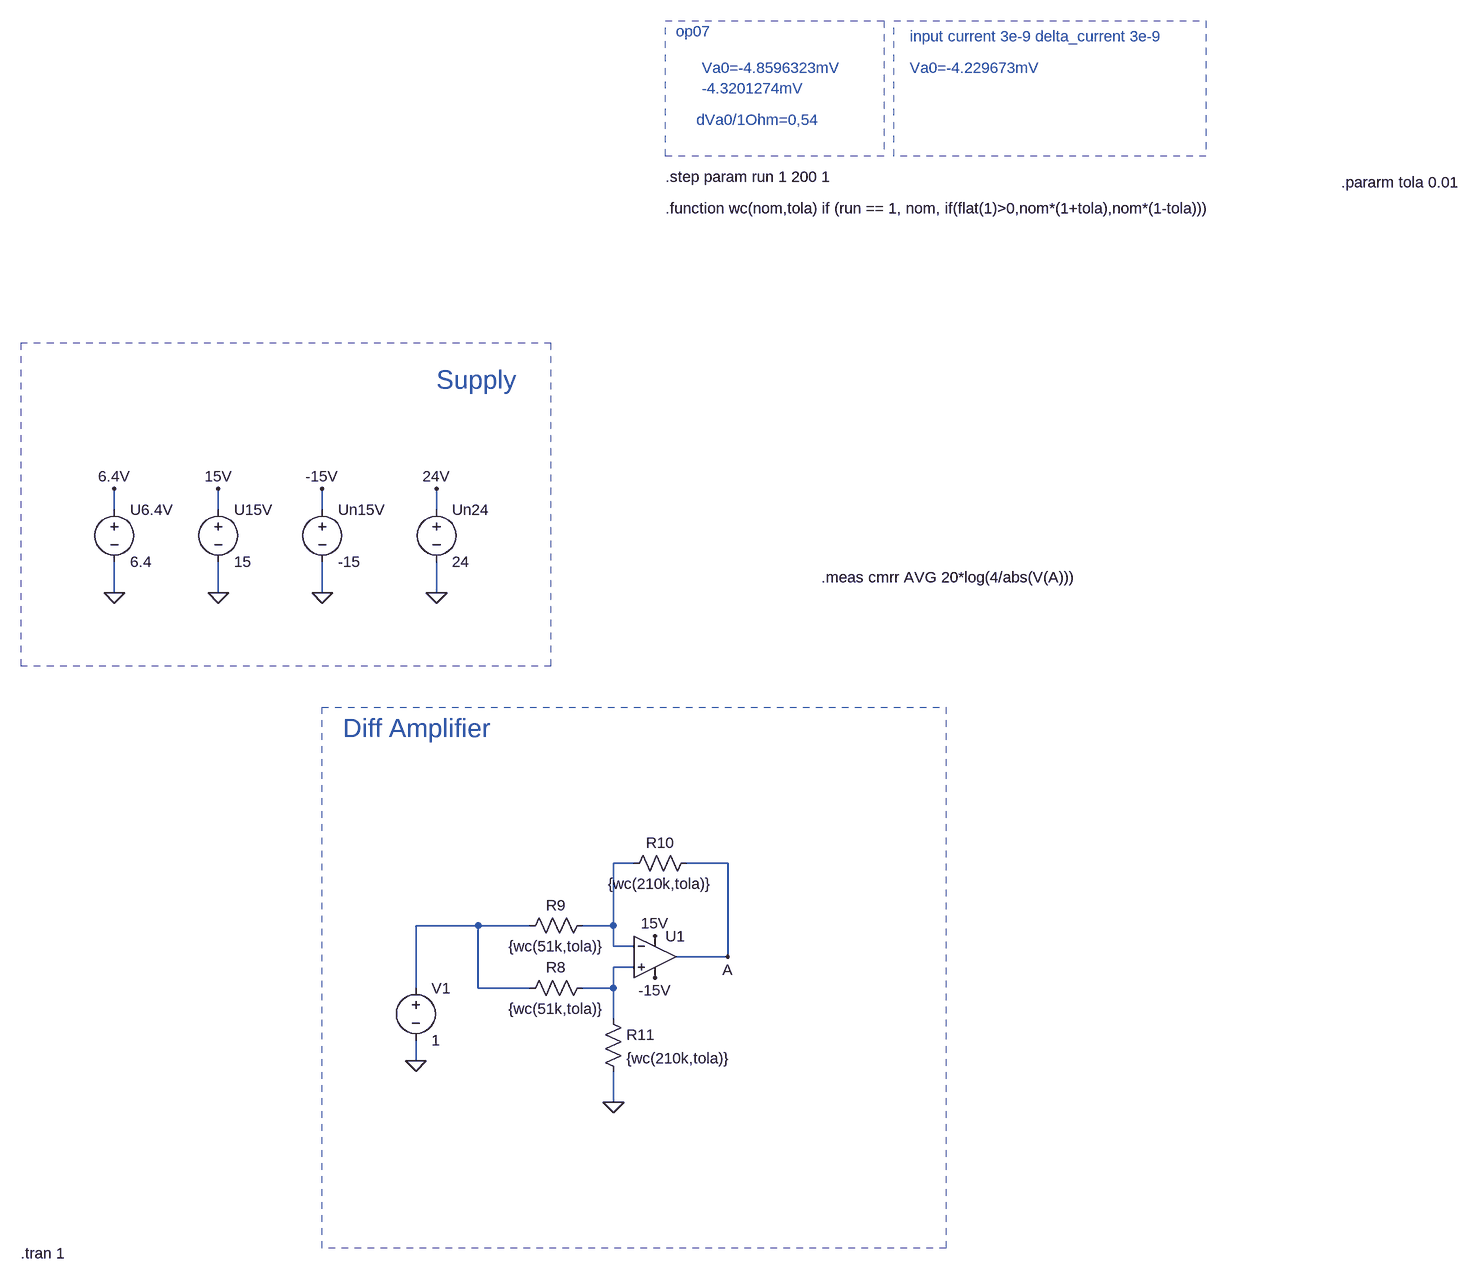
[diagram p0: schematic diff_amp_monte_carlo.asc]
diff_amp_monte_carlo.asc, the LTspice schematic file:
Version 4
SHEET 1 1512 1172
WIRE -1760 -544 -1760 -576
WIRE -1600 -544 -1600 -576
WIRE -1440 -544 -1440 -576
WIRE -1264 -544 -1264 -576
WIRE -1760 -416 -1760 -464
WIRE -1600 -416 -1600 -464
WIRE -1440 -416 -1440 -464
WIRE -1264 -416 -1264 -464
WIRE -960 0 -992 0
WIRE -816 0 -880 0
WIRE -1200 96 -1296 96
WIRE -1120 96 -1200 96
WIRE -992 96 -992 0
WIRE -992 96 -1040 96
WIRE -992 128 -992 96
WIRE -960 128 -992 128
WIRE -816 144 -816 0
WIRE -816 144 -896 144
WIRE -960 160 -992 160
WIRE -1296 192 -1296 96
WIRE -1200 192 -1200 96
WIRE -1120 192 -1200 192
WIRE -992 192 -992 160
WIRE -992 192 -1040 192
WIRE -992 240 -992 192
WIRE -1296 304 -1296 272
WIRE -992 368 -992 320
FLAG -1760 -416 0
FLAG -1760 -576 6.4V
FLAG -1600 -416 0
FLAG -1600 -576 15V
FLAG -1440 -416 0
FLAG -1440 -576 -15V
FLAG -992 368 0
FLAG -1264 -416 0
FLAG -1264 -576 24V
FLAG -816 144 A
FLAG -928 112 15V
FLAG -928 176 -15V
FLAG -1296 304 0
SYMBOL voltage -1760 -560 R0
WINDOW 123 0 0 Left 0
WINDOW 39 0 0 Left 0
SYMATTR InstName U6.4V
SYMATTR Value 6.4
SYMBOL voltage -1600 -560 R0
WINDOW 123 0 0 Left 0
WINDOW 39 0 0 Left 0
SYMATTR InstName U15V
SYMATTR Value 15
SYMBOL voltage -1440 -560 R0
WINDOW 123 0 0 Left 0
WINDOW 39 0 0 Left 0
SYMATTR InstName Un15V
SYMATTR Value -15
SYMBOL res -1024 80 R90
WINDOW 0 0 56 VBottom 2
WINDOW 3 32 56 VTop 2
SYMATTR InstName R9
SYMATTR Value {wc(51k,tola)}
SYMBOL res -1024 176 R90
WINDOW 0 0 56 VBottom 2
WINDOW 3 32 56 VTop 2
SYMATTR InstName R8
SYMATTR Value {wc(51k,tola)}
SYMBOL res -1008 224 R0
SYMATTR InstName R11
SYMATTR Value {wc(210k,tola)}
SYMBOL res -864 -16 R90
WINDOW 0 0 56 VBottom 2
WINDOW 3 32 56 VTop 2
SYMATTR InstName R10
SYMATTR Value {wc(210k,tola)}
SYMBOL voltage -1264 -560 R0
WINDOW 123 0 0 Left 0
WINDOW 39 0 0 Left 0
SYMATTR InstName Un24
SYMATTR Value 24
SYMBOL Opamps\\UniversalOpamp2 -928 144 R0
SYMATTR InstName U1
SYMATTR Value2 Avol=300k GBW=10Meg Slew=10Meg
SYMBOL voltage -1296 176 R0
WINDOW 123 0 0 Left 0
WINDOW 39 0 0 Left 0
SYMATTR InstName V1
SYMATTR Value 1
TEXT -1264 -744 Left 4 ;Supply
TEXT -1408 -208 Left 4 ;Diff Amplifier
TEXT -856 -1224 Left 2 ;Va0=-4.8596323mV
TEXT -864 -1144 Left 2 ;dVa0/1Ohm=0,54
TEXT -856 -1192 Left 2 ;-4.3201274mV
TEXT -896 -1280 Left 2 ;op07
TEXT -536 -1272 Left 2 ;input current 3e-9 delta_current 3e-9
TEXT -536 -1224 Left 2 ;Va0=-4.229673mV
TEXT -912 -1008 Left 2 !.function wc(nom,tola) if (run == 1, nom, if(flat(1)>0,nom*(1+tola),nom*(1-tola)))
TEXT -912 -1056 Left 2 !.step param run 1 200 1
TEXT 128 -1048 Left 2 !.pararm tola 0.01
TEXT -672 -440 Left 2 !.meas cmrr AVG 20*log(4/abs(V(A)))
TEXT -1904 600 Left 2 !.tran 1
RECTANGLE Normal -1088 -800 -1904 -304 2
RECTANGLE Normal -480 592 -1440 -240 2
RECTANGLE Normal -576 -1088 -912 -1296 2
RECTANGLE Normal -80 -1088 -560 -1296 2

The netlist it stands for:
* diff_amp_monte_carlo.asc
V§U6.4V 6.4V 0 6.4
V§U15V 15V 0 15
V§Un15V -15V 0 -15
R9 N001 N002 {wc(51k,tola)}
R8 N003 N002 {wc(51k,tola)}
R11 N003 0 {wc(210k,tola)}
R10 A N001 {wc(210k,tola)}
V§Un24 24V 0 24
XU1 N003 N001 15V -15V A level.2 Avol=300k GBW=10Meg Slew=10Meg ilimit=25m rail=0 Vos=0 phimargin=45 en=0 enk=0 in=0 ink=0 Rin=500Meg  ; pins IN+ IN- V+ V- OUT
V1 N002 0 1
* Supply
* Diff Amplifier
* Va0=-4.8596323mV
* dVa0/1Ohm=0,54
* -4.3201274mV
* op07
* input current 3e-9 delta_current 3e-9
* Va0=-4.229673mV
.function wc(nom,tola) if (run == 1, nom, if(flat(1)>0,nom*(1+tola),nom*(1-tola)))
.step param run 1 200 1
.pararm tola 0.01
.meas cmrr AVG 20*log(4/abs(V(A)))
.tran 1
.lib UniversalOpamps2.sub
.backanno
.end